# Altium schematic sheet Voeding.SchDoc: Voeding Soldeerbout
size A4; Date: 18/02/2022; Author: Robbe Th.; CompanyName: R-CyberSolutions; DrawnBy: Robbe Th.; Organization: R-CyberSolutions; DocumentNumber: 1/1; Revision: 1; SheetNumber: 1; SheetTotal: 5; Number: PXL_SEM2_SB01R1
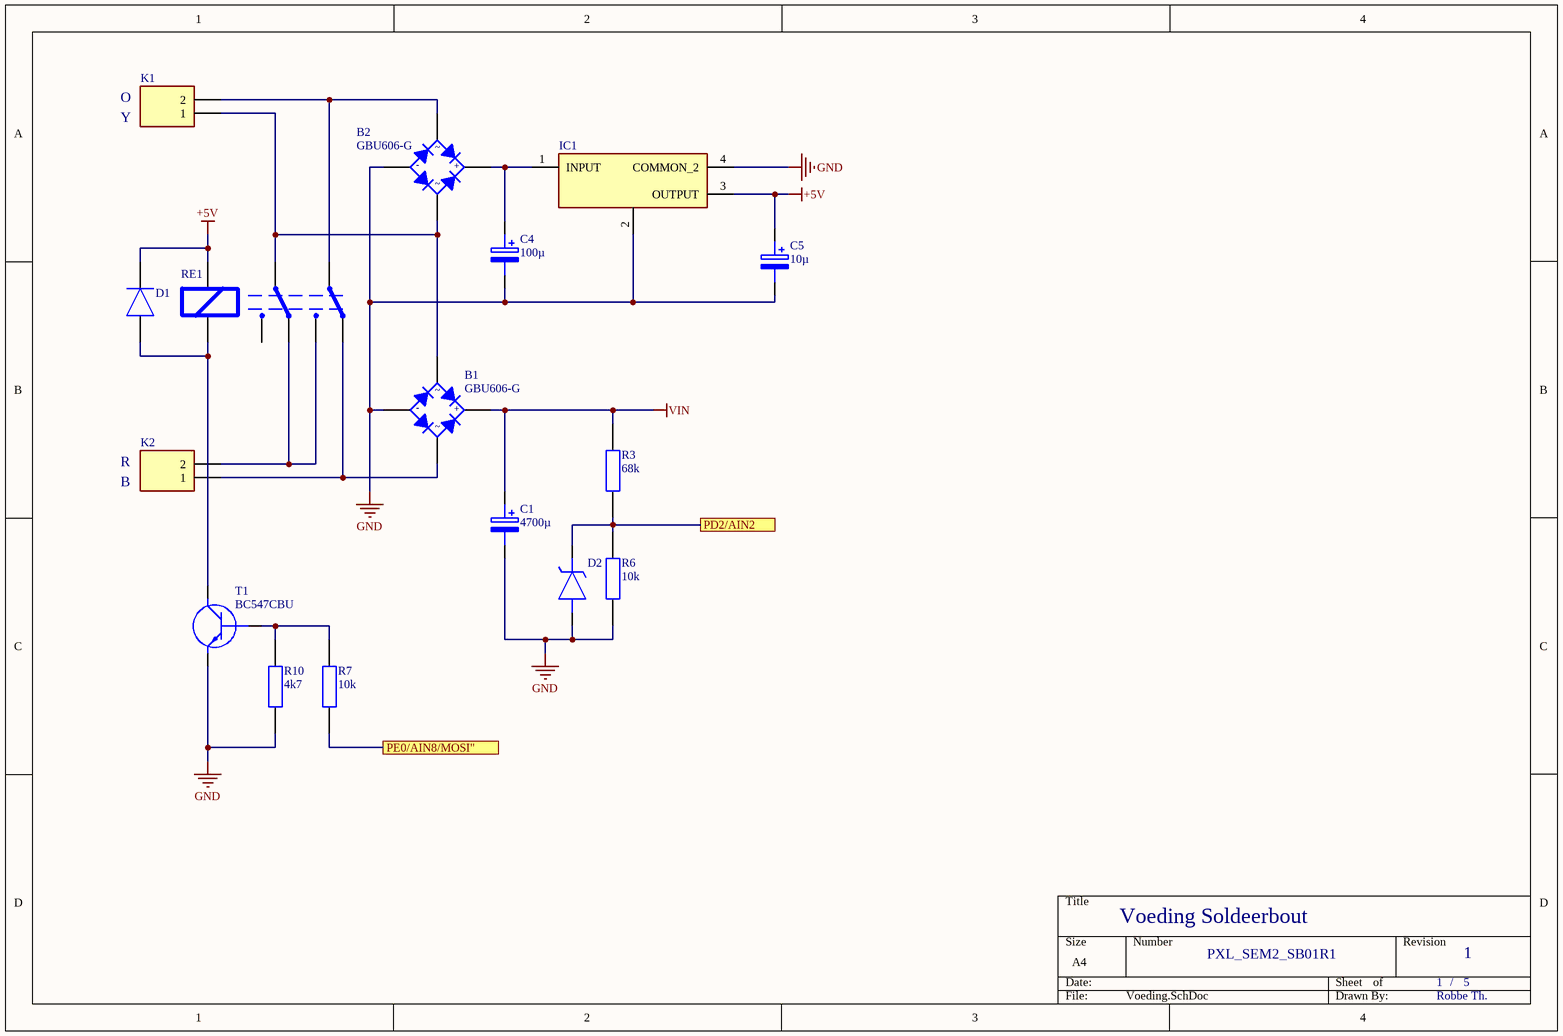
[diagram p0: Voeding.SchDoc]

## Parts
B1  GBU606-G  [GBU606G]
B2  GBU606-G  [GBU606G]
C1  4700µ  [CAPPRD750W80D1850H4150]
C4  100µ  [CAPPRD350W60D825H1300]
C5  10µ  [CAPPRD200W52D500H1250]
D1  FM4007W-W  [DIOM5025X231N]  (value not drawn)
D2  MMSZ4689T1G  [SOD3716X135N]  (value not drawn)
IC1  TL780-05CKTTR  [TL78005CKTTR]  (value not drawn)
K1  1716020000  [1716020000]  (value not drawn)
K2  1716020000  [1716020000]  (value not drawn)
R3  68k  [RESC2012X65N]
R6  10k  [RESC2012X65N]
R7  10k  [RESC2012X65N]
R10  4k7  [RESC2012X65N]
RE1  RT424005  [RT42]  (value not drawn)
T1  BC547CBU  [BC547CBU]

## Ports
PD2/AIN2, PE0/AIN8/MOSI"

## Nets
+5V: C5.1(+) D1.1(K) IC1.3(OUTPUT) RE1.1(A1_COIL)
GND: B1.4(-) B2.4(-) C1.2(-) C4.2(-) C5.2(-) D2.2(A) IC1.2(COMMON_1) IC1.4(COMMON_2) R6.1 R10.1 T1.3(E)
VIN: B1.1(+) C1.1(+) R3.2
PD2/AIN2: D2.1(K) R3.1 R6.2 ; port PD2/AIN2
PE0/AIN8/MOSI": R7.1 ; port PE0/AIN8/MOSI"
NetB1_2: B1.2 B2.3 K1.1 RE1.3(11_COM)
NetB1_3: B1.3 K2.1 RE1.7(22_NC)
NetB2_1: B2.1(+) C4.1(+) IC1.1(INPUT)
NetB2_2: B2.2 K1.2 RE1.6(21_COM)
NetD1_2: D1.2(A) RE1.8(A2_COIL) T1.1(C)
NetK2_2: K2.2 RE1.2(12_NC) RE1.5(24_NO)
NetR7_2: R7.2 R10.2 T1.2(B)

Not connected (* = marked no-connect by the designer): RE1 4(14_NO)

## Notes on the sheet
- O
- Y
- R
- B
- /

## Library data of the parts
B1 B2 = GBU606-G: Bridge Rectifier; Manufacturer_Name: Comchip Technology; Datasheet Link: https://www.comchiptech.com/product.php?id=2217; Height: 20.95mm; Manufacturer_Part_Number: GBU606-G; Mouser Part Number: 750-GBU606-G; Mouser Price/Stock: https://www.mouser.co.uk/ProductDetail/Comchip-Technology/GBU606-G?qs=XEIV%2Fho1H6d1WplLbEJ0gw%3D%3D; Arrow Part Number: GBU606-G; Arrow Price/Stock: https://www.arrow.com/en/products/gbu606-g/comchip-technology?region=nac
C1 = 50PK4700MEFC18X40: ELCO 4700 uF; Manufacturer_Name: Rubycon; Datasheet Link: http://www.rubycon.co.jp/en/catalog/e_pdfs/aluminum/e_pk.pdf; Height: 41.5mm; Manufacturer_Part_Number: 50PK4700MEFC18X40; Mouser Part Number: 232-50PK4700MEFC18X4; Mouser Price/Stock: https://www.mouser.co.uk/ProductDetail/Rubycon/50PK4700MEFC18X40?qs=T3oQrply3y8fu7oTpkJ7DA%3D%3D; Arrow Part Number: 50PK4700MEFC18X40; Arrow Price/Stock: https://www.arrow.com/en/products/50pk4700mefc18x40/rubycon
C4 = RGA101M1HBK-0811G: ELCO 100 uF; Manufacturer_Name: Lelon; Datasheet Link: https://www.arrow.com/en/products/rga101m1hbk-0811g/lelon-electronics; Height: 13mm; Manufacturer_Part_Number: RGA101M1HBK-0811G; Mouser Part Number: 140-RGA101M1HBK0811G; Mouser Price/Stock: https://www.mouser.co.uk/ProductDetail/Lelon/RGA101M1HBK-0811G?qs=pNDdEcSXiOBNivHdElCSJA%3D%3D; Arrow Part Number: RGA101M1HBK-0811G; Arrow Price/Stock: https://www.arrow.com/en/products/rga101m1hbk-0811g/lelon-electronics
C5 = 860020672010: ELCO 10 uF; Manufacturer_Name: Wurth Elektronik; Datasheet Link: https://katalog.we-online.de/pbs/datasheet/860020672010.pdf; Height: 12.5mm; Manufacturer_Part_Number: 860020672010; Mouser Part Number: 710-860020672010; Mouser Price/Stock: https://www.mouser.co.uk/ProductDetail/Wurth-Elektronik/860020672010?qs=0KOYDY2FL2%252BaHkqkc1q4lw%3D%3D
D1 = FM4007W-W: Diode 1000V 1A; Manufacturer_Name: Rectron; Datasheet Link: http://www.rectron.com/data_sheets/fm4001w-fm4007w.pdf; Height: 2.31mm; Manufacturer_Part_Number: FM4007W-W; Mouser Part Number: 583-FM4007W-W; Mouser Price/Stock: https://www.mouser.co.uk/ProductDetail/Rectron/FM4007W-W?qs=jY2200qj%252BWCBLCSrfIQtJA%3D%3D; Arrow Part Number: FM4007W-W; Arrow Price/Stock: https://www.arrow.com/en/products/fm4007w-w/rectron?region=nac
D2 = MMSZ4689T1G: Zener Diode; Manufacturer_Name: ON Semiconductor; Datasheet Link: http://www.onsemi.com/pub/Collateral/MMSZ4678T1-D.PDF; Height: 1.35mm; Manufacturer_Part_Number: MMSZ4689T1G; Mouser Part Number: 863-MMSZ4689T1G; Mouser Price/Stock: https://www.mouser.co.uk/ProductDetail/ON-Semiconductor/MMSZ4689T1G/?qs=P4IOph%252Bbot%252Blaz%2FZtdyBaA%3D%3D; Arrow Part Number: MMSZ4689T1G; Arrow Price/Stock: https://www.arrow.com/en/products/mmsz4689t1g/on-semiconductor
IC1 = TL780-05CKTTR: Voltage Regulator 5V; Manufacturer_Name: Texas Instruments; Datasheet Link: http://www.ti.com/general/docs/suppproductinfo.tsp?distId=26&gotoUrl=http%3A%2F%2Fwww.ti.com%2Flit%2Fgpn%2Ftl780; Height: 5.08mm; Manufacturer_Part_Number: TL780-05CKTTR; Mouser Part Number: 595-TL780-05CKTTR; Mouser Price/Stock: https://www.mouser.co.uk/ProductDetail/Texas-Instruments/TL780-05CKTTR?qs=7kv20MEVUlhtPP21hgiOlA%3D%3D; Arrow Part Number: TL780-05CKTTR; Arrow Price/Stock: https://www.arrow.com/en/products/tl780-05ckttr/texas-instruments?region=nac
K1 K2 = 1716020000: Printkroonsteen 2 POL; Manufacturer_Name: Weidmuller; Datasheet Link: https://catalog.weidmueller.com/catalog/Start.do?ObjectID=1716020000&_ga=2.21797499.1716783809.1613378202-511725545.1613378202; Manufacturer_Part_Number: 1716020000; Mouser Part Number: 470-1716020000; Mouser Price/Stock: https://www.mouser.co.uk/ProductDetail/Weidmuller/1716020000?qs=WJDKaGZ8K%252B7GSEFQgvMjVA%3D%3D
R3 R6 R7 R10 = CPF0805B100RE1: Resistor SMD 0805; Manufacturer_Name: TE Connectivity; Datasheet Link: https://datasheet.datasheetarchive.com/originals/distributors/DKDS-21/401696.pdf; Height: 0.65mm; Manufacturer_Part_Number: CPF0805B100RE1; Mouser Part Number: 279-CPF0805B100RE1; Mouser Price/Stock: https://www.mouser.co.uk/ProductDetail/TE-Connectivity-Holsworthy/CPF0805B100RE1?qs=9ylKvqdyudkCWLPT1QvLZQ%3D%3D; Arrow Part Number: CPF0805B100RE1; Arrow Price/Stock: https://www.arrow.com/en/products/cpf0805b100re1/te-connectivity?region=nac
RE1 = RT424005: Contactor; Manufacturer_Name: TE Connectivity; Datasheet Link: https://www.te.com/commerce/DocumentDelivery/DDEController?Action=showdoc&DocId=Data+Sheet%7FRT2%7F1014%7Fpdf%7FEnglish%7FENG_DS_RT2_1014.pdf%7F5-1393243-9; Manufacturer_Part_Number: RT424005; Mouser Part Number: 655-RT424005; Mouser Price/Stock: https://www.mouser.co.uk/ProductDetail/TE-Connectivity-Schrack/RT424005?qs=KKrrU%252BaSadKRsQcVuAjnsQ%3D%3D; Arrow Part Number: RT424005; Arrow Price/Stock: https://www.arrow.com/en/products/rt424005/te-connectivity?region=nac
T1 = BC547CBU: Transistor BJT NPN; Manufacturer_Name: ON Semiconductor; Datasheet Link: https://www.onsemi.com/pdf/datasheet/bc550-d.pdf; Height: 5.33mm; Manufacturer_Part_Number: BC547CBU; Mouser Part Number: 512-BC547CBU; Mouser Price/Stock: https://www.mouser.co.uk/ProductDetail/ON-Semiconductor-Fairchild/BC547CBU/?qs=SpPkH8nd0tbX52Pj0mX5Aw%3D%3D; Arrow Part Number: BC547CBU; Arrow Price/Stock: https://www.arrow.com/en/products/bc547cbu/on-semiconductor?region=nac